# EasyEDA schematic SCH_Rydful-Beacon_2026-01-27.json
TITLE: Sheet_1; REV: 1.0; Date: 2025-12-11; Sheet: 1/1; Drawn By: 0th; Company: Your Company
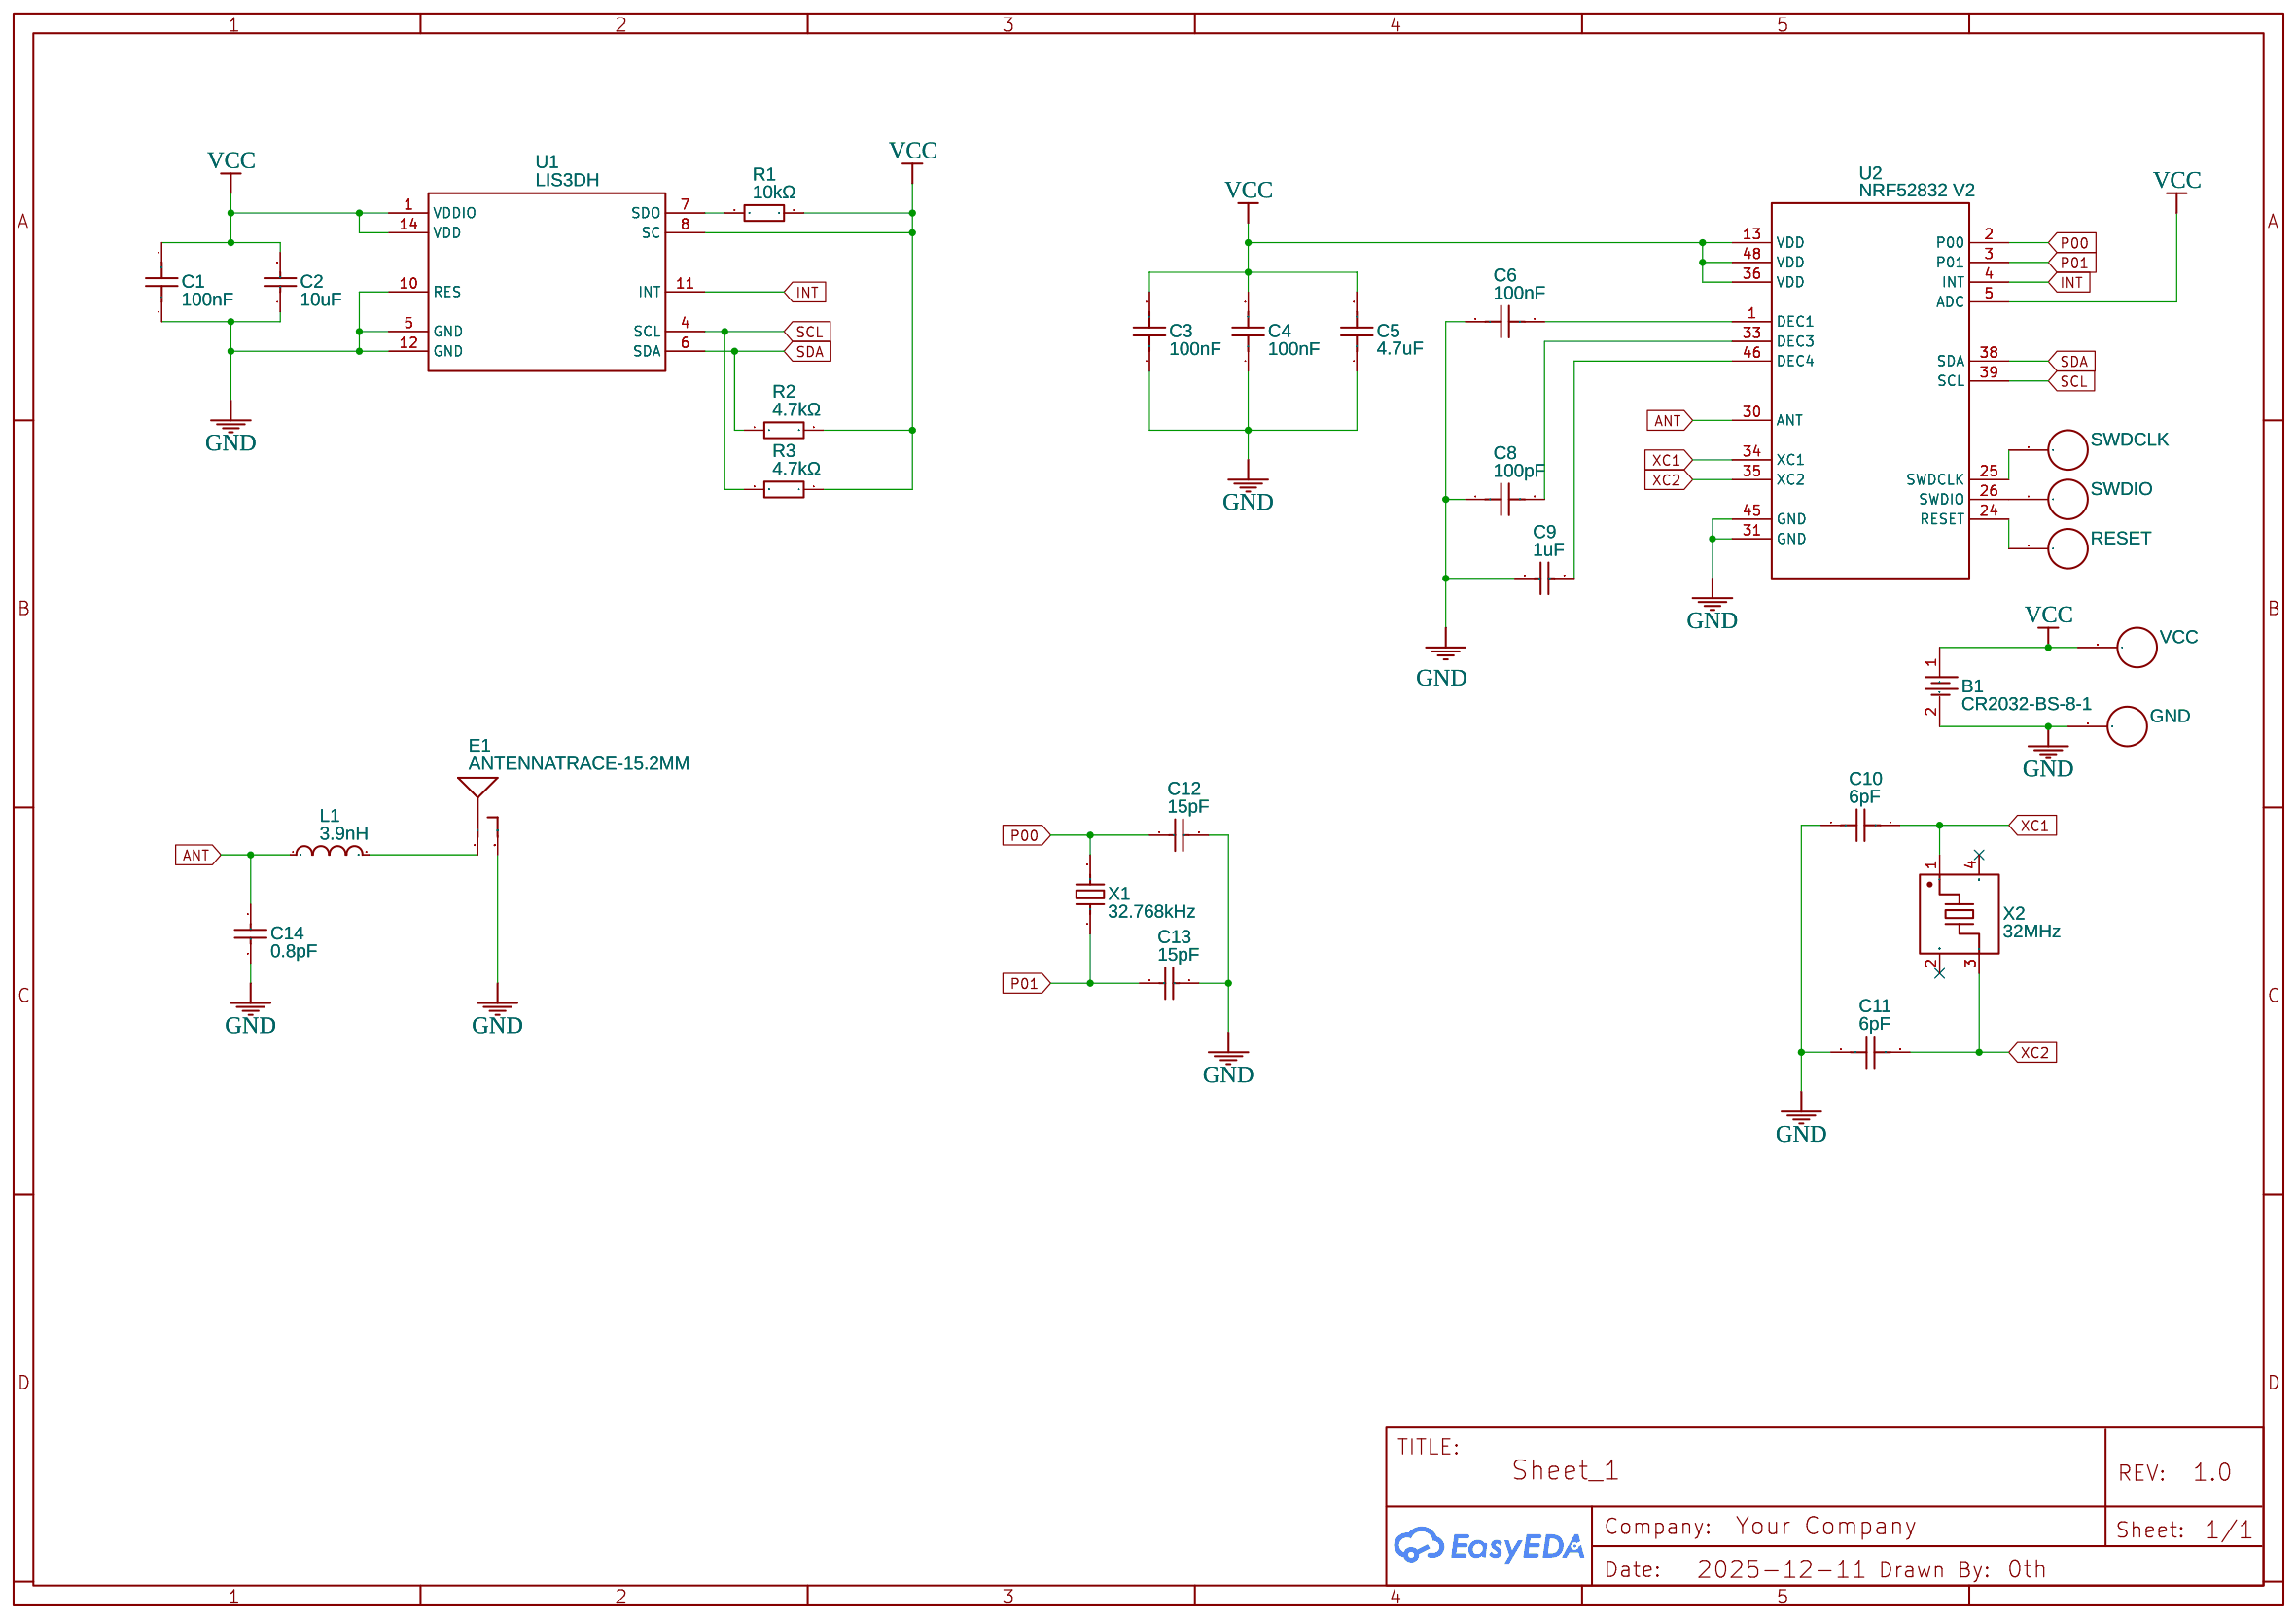
[diagram p0: schematic sheet]

## Parts
B1  CR2032-BS-8-1  [BAT-TH_BS-8-1]
C1  100nF  [C0402]
C2  10uF  [C0603]
C3  100nF  [C0402]
C4  100nF  [C0402]
C5  4.7uF  [C0603]
C6  100nF  [C0402]
C8  100pF  [C0402]
C9  1uF  [C0402]
C10  6pF  [C0402]
C11  6pF  [C0402]
C12  15pF  [C0402]
C13  15pF  [C0402]
C14  0.8pF  [C0402]
E1  ANTENNATRACE-15.2MM  [TRACE_ANTENNA_2.4GHZ_15.2MM]
GND  pad  [PAD-SMD-3MM]
L1  3.9nH  [IND-SMD_L1.0-W0.5-2]
R1  10kΩ  [R0402]
R2  4.7kΩ  [R0402]
R3  4.7kΩ  [R0402]
RESET  pad  [PAD-SMD-3MM]
SWDCLK  pad  [PAD-SMD-3MM]
SWDIO  pad  [PAD-SMD-3MM]
U1  LIS3DH  [LGA-16_L3.0-W3.0-P0.50-TL]
U2  NRF52832 V2  [QFN-48_L6.0-W6.0-P0.40-BL-EP3.8]
VCC  pad  [PAD-SMD-3MM]
X1  32.768kHz  [CRYSTAL-SMD_L3.2-W1.5-FC-135R32.7680KF-A3]
X2  32MHz  [CRYSTAL-SMD_4P-L2.5-W2.0-BL]

## Library data of the parts
B1 = CR2032-BS-8-1: Supplier: LCSC; Manufacturer: QIJEY; Manufacturer Part: BS-8-1; Supplier Part: C70378; JLCPCB Part Class: Extended Part; Package Display: No
C1 = CC0402KRX7R7BB104: Supplier: LCSC; Supplier Part: C60474; JLCPCB Part Class: Extended Part
C2 = 0603X106K160NT: Supplier: LCSC; Supplier Part: C19702; JLCPCB Part Class: Extended Part
C3 C4 C6 = CC0402KRX7R7BB104: Supplier: LCSC; Supplier Part: C60474
C5 = CL10A475KO8NNNC: Supplier: LCSC; Supplier Part: C18185770
C8 = CGA0402C0G101J160GT: Supplier: LCSC; Supplier Part: C526991; Contributor: lcsc
C9 = CL05A105KO5NNNC: Supplier: LCSC; Manufacturer: SAMSUNG(三星); Supplier Part: C29266; JLCPCB Part Class: Extended Part
C10 C11 = TCC0402COG6R0C500AT: Contributor: LCSC; Supplier: LCSC; Supplier Part: C696878; Manufacturer: CCTC(三环); JLCPCB Part Class: Extended Part
C12 C13 = 0402CG150J500NT: Supplier: LCSC; Manufacturer: FH(风华); Supplier Part: C1548; JLCPCB Part Class: Basic Part
C14 = 0402CG0R8C500NT: Supplier: LCSC; Manufacturer: FH(风华); Supplier Part: C40459; JLCPCB Part Class: Extended Part
E1 = ANTENNATRACE-15.2MM: Contributor: philip boser
GND RESET SWDCLK SWDIO VCC = pad: Contributor: animesh-lichi; libConvert: Yes; Add into BOM: Yes
L1 = LQW15AN3N9B00D: Supplier: LCSC; Manufacturer: muRata(村田); Supplier Part: C98062; JLCPCB Part Class: Extended Part
R1 = 0603WAF1002T5E: Supplier: LCSC; Supplier Part: C25744
R2 R3 = 0603WAF4701T5E: Supplier: LCSC; Supplier Part: C25900
U1 = LIS3DH: Manufacturer: ST(意法半导体); Manufacturer Part: LIS3DHTR; Supplier: LCSC; Supplier Part: C15134; Contributor: 0th
U2 = NRF52832 V2: Manufacturer: NORDIC; Manufacturer Part: NRF52832-QFAA-R; Supplier: LCSC; Supplier Part: C77540; Contributor: 0th
X1 = XTF32032768KT00351011: Supplier: LCSC; Supplier Part: C37635362; Manufacturer: 同晶; JLCPCB Part Class: Extended Part; Contributor: lcsc
X2 = 7E32000E09UCG: Supplier: LCSC; Supplier Part: C524677; Manufacturer: SJK(晶科鑫); JLCPCB Part Class: Extended Part; Contributor: lcsc

## Nets
GND: B1.2 C1.1 C2.1 C3.1 C4.1 C5.1 C6.2 C8.1 C9.1 C10.1 C11.1 C12.2 C13.2 C14.2 E1.GND GND.1 U1.5(GND) U1.10(RES) U1.12(GND) U2.31(GND) U2.45(GND)
VCC: B1.1 C1.2 C2.2 C3.2 C4.2 C5.2 R1.1 R2.2 R3.1 U1.1(VDDIO) U1.8(SC) U1.14(VDD) U2.5(ADC) U2.13(VDD) U2.36(VDD) U2.48(VDD) VCC.1
ANT: C14.1 L1.1 U2.30(ANT)
INT: U1.11(INT) U2.4(INT)
P00: C12.1 U2.2(P00) X1.2
P01: C13.1 U2.3(P01) X1.1
SCL: R3.2 U1.4(SCL) U2.39(SCL)
SDA: R2.1 U1.6(SDA) U2.38(SDA)
XC1: C10.2 U2.34(XC1) X2.1
XC2: C11.2 U2.35(XC2) X2.3
Net-(C6-1): C6.1 U2.1(DEC1)
Net-(C8-2): C8.2 U2.33(DEC3)
Net-(C9-2): C9.2 U2.46(DEC4)
Net-(E1-ANT): E1.ANT(SIGNAL) L1.2
Net-(R1-2): R1.2 U1.7(SDO)
Net-(RESET-1): RESET.1 U2.24(RESET)
Net-(SWDCLK-1): SWDCLK.1 U2.25(SWDCLK)
Net-(SWDIO-1): SWDIO.1 U2.26(SWDIO)

Not connected (* = marked no-connect by the designer): X2 2(GND)* 4(GND)*
